# EAGLE schematic hexapod_mk2_v0.0 (EAGLE 9.6.2)
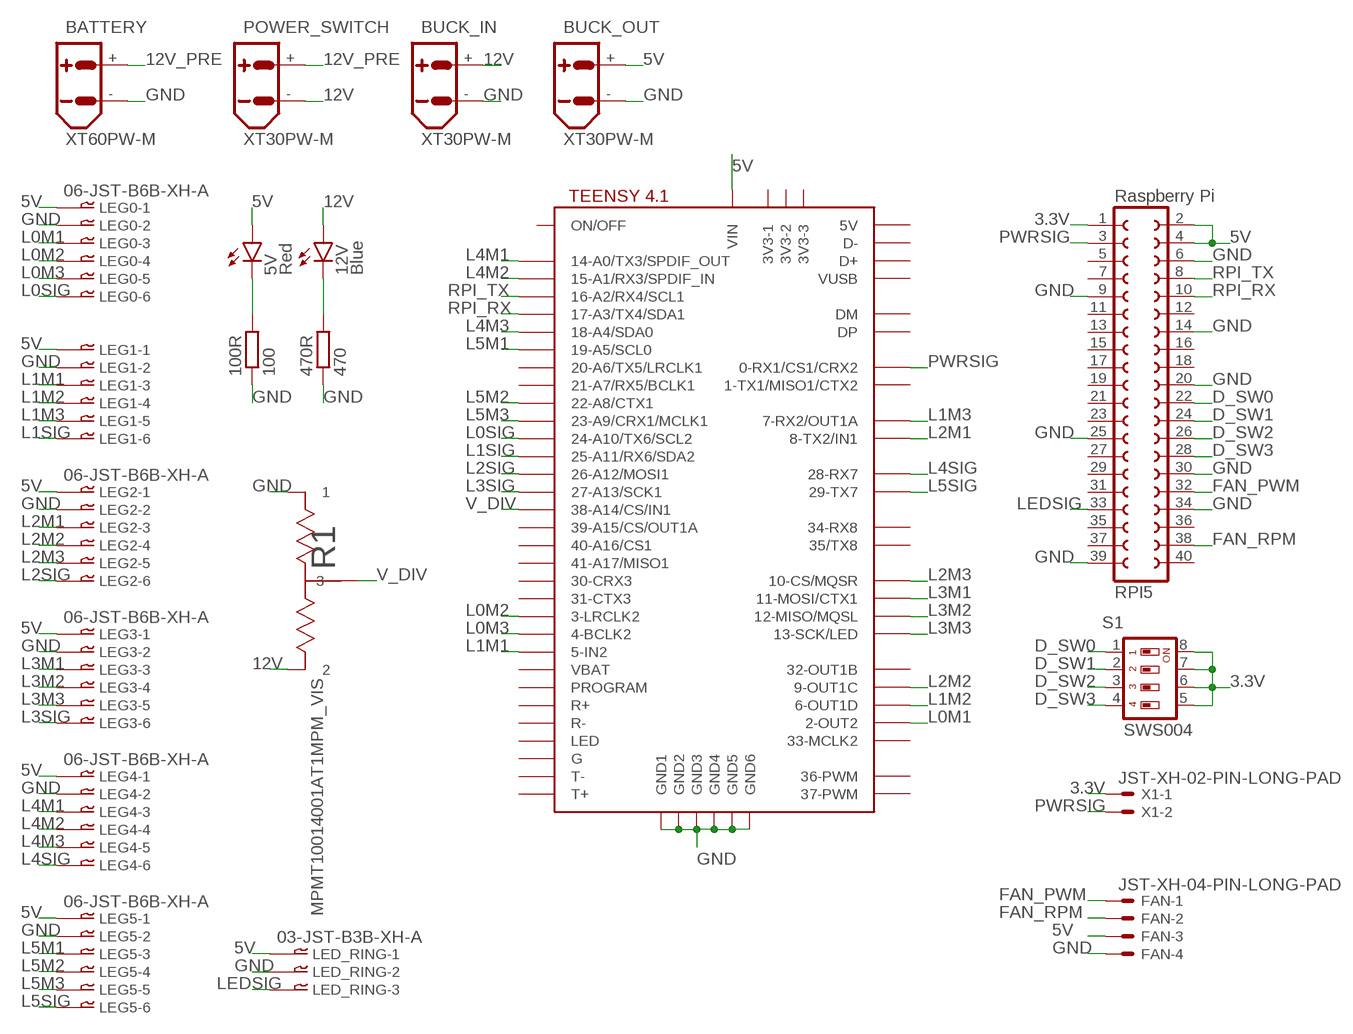
[diagram p0: schematic, sheet 1]

## Parts
5V  Red  LEDCHIPLED_0805  [CHIPLED_0805]
12V  Blue  LEDCHIPLED_0805  [CHIPLED_0805]
100R  100  R-EU_R0805  [R0805]
470R  470  R-EU_R0805  [R0805]
BATTERY  XT60PW-M  [XT60PW-M]
BUCK_IN  XT30PW-M  [XT30PW-M]
BUCK_OUT  XT30PW-M  [XT30PW-M]
FAN  JST-XH-04-PIN-LONG-PAD  [JST-XH-04-PACKAGE-LONG-PAD]
LED_RING  03-JST-B3B-XH-A  [B3B-XH]
LEG0  06-JST-B6B-XH-A  [B6B-XH]
LEG1  06-JST-B6B-XH-A  [B6B-XH]
LEG2  06-JST-B6B-XH-A  [B6B-XH]
LEG3  06-JST-B6B-XH-A  [B6B-XH]
LEG4  06-JST-B6B-XH-A  [B6B-XH]
LEG5  06-JST-B6B-XH-A  [B6B-XH]
POWER_SWITCH  XT30PW-M  [XT30PW-M]
R1  MPMT10014001AT1MPM_VIS  [MPM_VIS]
RPI5  Raspberry Pi  FE20-2  [FE20-2]
S1  SWS004  [SMS-004]
U$1  TEENSY41  [TEENSY41]
X1  JST-XH-02-PIN-LONG-PAD  [JST-XH-02-PACKAGE-LONG-PAD]

## Nets
3.3V: RPI5.1 S1.5 S1.6 S1.7 S1.8 X1.1
5V: 5V.A BUCK_OUT.+ FAN.3 LED_RING.P$1 LEG0.P$1 LEG1.P$1 LEG2.P$1 LEG3.P$1 LEG4.P$1 LEG5.P$1 RPI5.2 RPI5.4 U$1.VIN
12V: 12V.A BUCK_IN.+ POWER_SWITCH.- R1.2
12V_PRE: BATTERY.+ POWER_SWITCH.+
D_SW0: RPI5.22 S1.1
D_SW1: RPI5.24 S1.2
D_SW2: RPI5.26 S1.3
D_SW3: RPI5.28 S1.4
FAN_PWM: FAN.1 RPI5.32
FAN_RPM: FAN.2 RPI5.38
GND: 100R.1 470R.1 BATTERY.- BUCK_IN.- BUCK_OUT.- FAN.4 LED_RING.P$2 LEG0.P$2 LEG1.P$2 LEG2.P$2 LEG3.P$2 LEG4.P$2 LEG5.P$2 R1.1 RPI5.6 RPI5.9 RPI5.14 RPI5.20 RPI5.25 RPI5.30 RPI5.34 RPI5.39 U$1.GND1 U$1.GND2 U$1.GND3 U$1.GND4 U$1.GND5 U$1.GND6
L0M1: LEG0.P$3 U$1.2-OUT2
L0M2: LEG0.P$4 U$1.3-LRCLK2
L0M3: LEG0.P$5 U$1.4-BCLK2
L0SIG: LEG0.P$6 U$1.24-A10/TX6/SCL2
L1M1: LEG1.P$3 U$1.5-IN2
L1M2: LEG1.P$4 U$1.6-OUT1D
L1M3: LEG1.P$5 U$1.7-RX2/OUT1A
L1SIG: LEG1.P$6 U$1.25-A11/RX6/SDA2
L2M1: LEG2.P$3 U$1.8-TX2/IN2(8-TX2/IN1)
L2M2: LEG2.P$4 U$1.9-OUT1C
L2M3: LEG2.P$5 U$1.10-CS\MQSR(10-CS/MQSR)
L2SIG: LEG2.P$6 U$1.26-A12/MOSI1
L3M1: LEG3.P$3 U$1.11-MOSI/CTX1
L3M2: LEG3.P$4 U$1.12-MISO/MQSL
L3M3: LEG3.P$5 U$1.13-SCK/LED
L3SIG: LEG3.P$6 U$1.27-A13/SCK1
L4M1: LEG4.P$3 U$1.14-A0/TX3/SPDIF_OUT
L4M2: LEG4.P$4 U$1.15-A1/RX3/SPDIF_IN
L4M3: LEG4.P$5 U$1.18-A4/SDA0
L4SIG: LEG4.P$6 U$1.28-RX7
L5M1: LEG5.P$3 U$1.19-A5/SCL0
L5M2: LEG5.P$4 U$1.22-A8/CTX1
L5M3: LEG5.P$5 U$1.23-A9/CRX1/MCLK1
L5SIG: LEG5.P$6 U$1.29-TX7
LEDSIG: LED_RING.P$3 RPI5.33
N$1: 5V.C 100R.2
N$2: 12V.C 470R.2
PWRSIG: RPI5.3 U$1.0-RX1/CS1/CRX2 X1.2
RPI_RX: RPI5.10 U$1.17-A3/TX4/SDA1
RPI_TX: RPI5.8 U$1.16-A2/RX4/SCL1
V_DIV: R1.3 U$1.38-A14/CS/IN1
Unconnected: RPI5.5 RPI5.7 RPI5.11 RPI5.12 RPI5.13 RPI5.15 RPI5.16 RPI5.17 RPI5.18 RPI5.19 RPI5.21 RPI5.23 RPI5.27 RPI5.29 RPI5.31 RPI5.35 RPI5.36 RPI5.37 RPI5.40 U$1.1-TX1/MISO1/CTX2 U$1.3V3-1 U$1.3V3-2 U$1.3V3-3 U$1.20-A6/TX5/LRCLK1 U$1.21-A7/RX5/BCLK1 U$1.30-CRX3 U$1.31-CTX3 U$1.32-OUT1B U$1.33-MCLK2 U$1.34-RX8 U$1.35-TX8(35/TX8) U$1.36-PWM U$1.37-PWM U$1.39-A15/CS/OUT1A U$1.40-A16/CS1 U$1.41-A17/MISO1 U$1.+5V(5V) U$1.D+ U$1.D- U$1.DM U$1.DP U$1.G U$1.LED U$1.ON/OFF U$1.PROGRAM U$1.R+ U$1.R- U$1.T+ U$1.T- U$1.VBAT U$1.VUSB

## Library data of the parts
5V 12V = led:LED: LED OSRAM: - CHIPLED LG R971, LG N971, LY N971, LG Q971, LY Q971, LO R971, LY R971 LH N974, LH R974 LS Q976, LO Q976, LY Q976 LO Q996 - Hyper CHIPLED LW Q18S LB Q993, LB Q99A, LB R99A - SideLED LS A670, LO A670, LY A670, LG A670, LP A670 LB A673, LV A673, LT A673, LW A673 LH A674 LY A675 LS A676, LA A676, LO A676, LY A676, LW A676 LS A679, LY A679, LG A679 - Hyper Micro SIDELED® LS Y876, LA Y876, LO Y876, LY Y876 LT Y87S - SmartLED LW L88C, LW L88S LB L89C, LB L89S, LG L890 LS L89K, LO L89K, LY L89K LS L896, LA L896, LO L896, LY L896 - TOPLED LS T670, LO T670, LY T670, LG T670, LP T670 LSG T670, LSP T670, LSY T670, LOP T670, LYG T670 LG T671, LOG T671, LSG T671 LB T673, LV T673, LT T673, LW T673 LH T674 LS T676, LA T676, LO T676, LY T676, LB T676, LH T676, LSB T676, LW T676 LB T67C, LV T67C, LT T67C, LS T67K, LO T67K, LY T67K, LW E67C LS E67B, LA E67B, LO E67B, LY E67B, LB E67C, LV E67C, LT E67C LW T67C LS T679, LY T679, LG T679 LS T770, LO T770, LY T770, LG T770, LP T770 LB T773, LV T773, LT T773, LW T773 LH T774 LS E675, LA E675, LY E675, LS T675 LS T776, LA T776, LO T776, LY T776, LB T776 LHGB T686 LT T68C, LB T68C - Hyper Mini TOPLED® LB M676 - Mini TOPLED Santana® LG M470 LS M47K, LO M47K, LY M47K Source: http://www.osram.convergy.de LUXEON: - LUMILED® LXK2-PW12-R00, LXK2-PW12-S00, LXK2-PW14-U00, LXK2-PW14-V00 LXK2-PM12-R00, LXK2-PM12-S00, LXK2-PM14-U00 LXK2-PE12-Q00, LXK2-PE12-R00, LXK2-PE12-S00, LXK2-PE14-T00, LXK2-PE14-U00 LXK2-PB12-K00, LXK2-PB12-L00, LXK2-PB12-M00, LXK2-PB14-N00, LXK2-PB14-P00, LXK2-PB14-Q00 LXK2-PR12-L00, LXK2-PR12-M00, LXK2-PR14-Q00, LXK2-PR14-R00 LXK2-PD12-Q00, LXK2-PD12-R00, LXK2-PD12-S00 LXK2-PH12-R00, LXK2-PH12-S00 LXK2-PL12-P00, LXK2-PL12-Q00, LXK2-PL12-R00 Source: www.luxeon.com KINGBRIGHT: KA-3528ASYC Source: www.kingbright.com
100R 470R = rcl:R-EU_: RESISTOR, European symbol; SPICEPREFIX: R
BATTERY = amass:XT60: AMASS XT60 connector Store in Japan AMASS XT60 connector <https://szc.jp/ams-xt60>
BUCK_IN BUCK_OUT POWER_SWITCH = amass:XT30: AMASS XT30 connector Store in Japan AMASS XT30 connector <https://szc.jp/ams-xt30>
FAN = Rembrandt Electronics - JST XH Connectors v1-0:JST-XH-04-PIN: JST XH Connector 2 Pin Wire to board connector. Pitch: 2,54 mm, (0.100") Number of pins: 4 Created by Rembrandt Electronics www.rembrandtelectronics.com
LED_RING = bt_con-jst-xh:03-JST: JST CONNECTOR
LEG0 LEG1-LEG5 = bt_con-jst-xh:06-JST: JST CONNECTOR
R1 = MPMT10014001AT1:MPMT10014001AT1; COPYRIGHT: Copyright (C) 2024 Ultra Librarian. All rights reserved.; MANUFACTURER_PART_NUMBER: MPMT10014001AT1; MFR_NAME: Vishay
RPI5 = con-lsta:FE20-2: FEMALE HEADER; OC_FARNELL: unknown; OC_NEWARK: unknown
S1 = smd-special:SWS004: SMD Dip Switch 4 pol.
U$1 = teensy:TEENSY41
X1 = Rembrandt Electronics - JST XH Connectors v1-0:JST-XH-02-PIN: JST XH Connector 2 Pin Wire to board connector. Pitch: 2,54 mm, (0.100") Number of pins: 2 Created by Rembrandt Electronics www.rembrandtelectronics.com

## Module RASPBERRYPI_PINOUT
Ports: 

### Library data of the parts

## Net classes
0 default: clearance 0.205 mm